# Altium schematic sheet 原理图.SchDoc
size A3
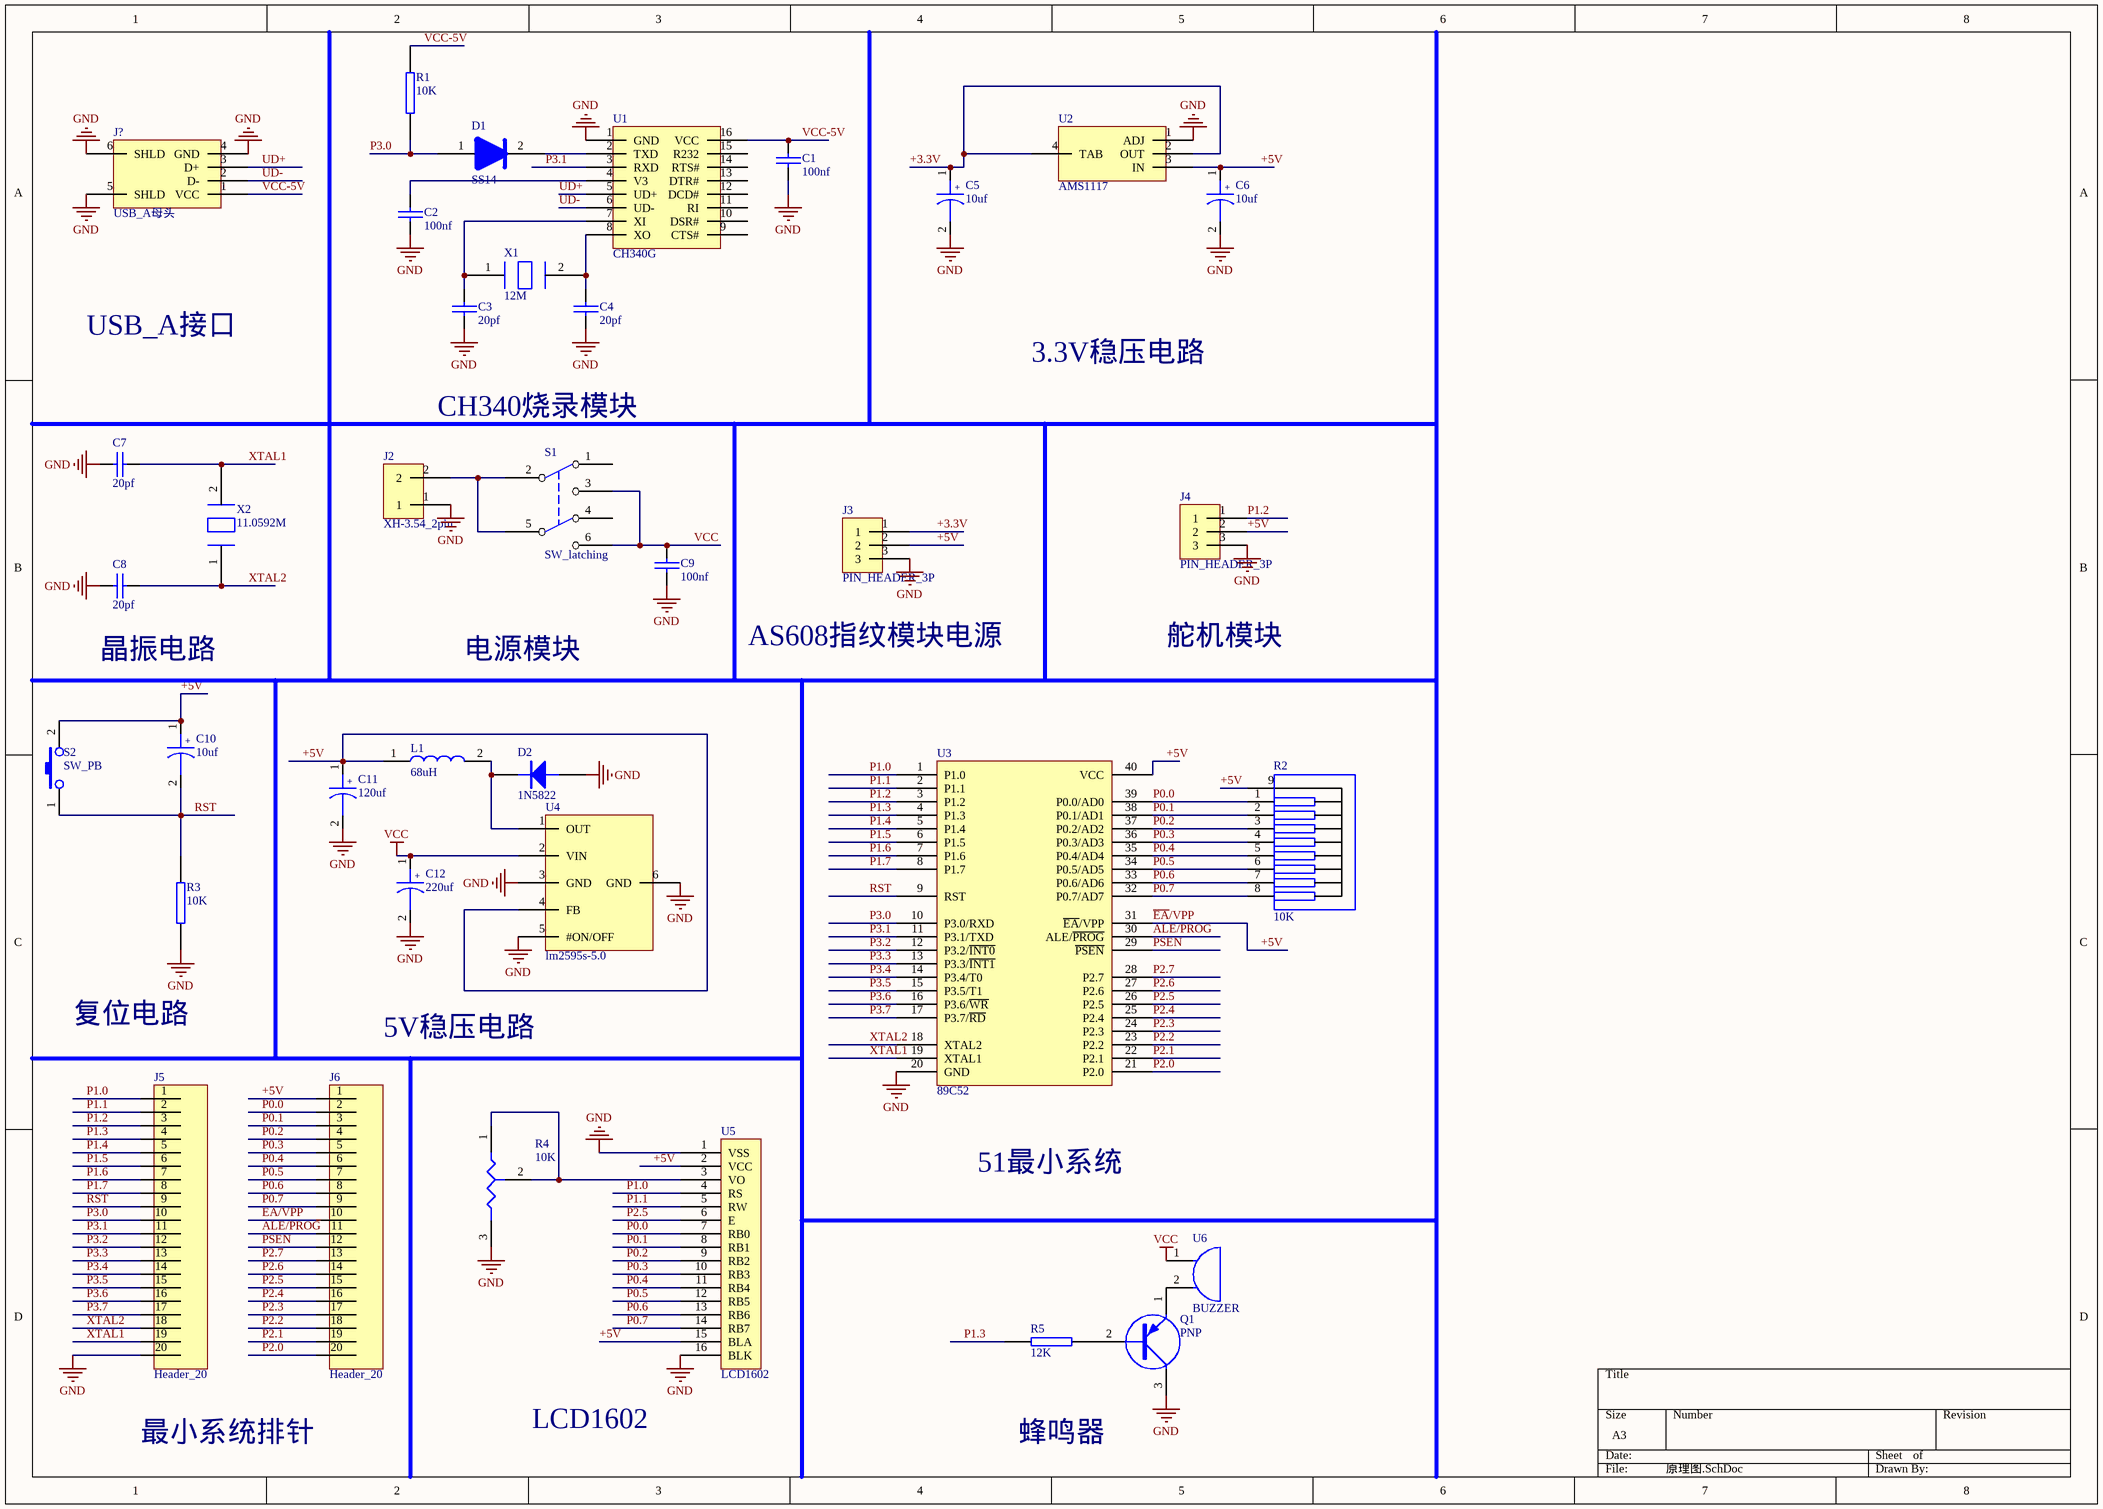
[diagram p0: 原理图.SchDoc]

## Parts
C1  100nf  [CAP_C]
C2  100nf  [CAP_C]
C3  20pf  [CAP_C]
C4  20pf  [CAP_C]
C5  10uf  [CAP_POL]
C6  10uf  [CAP_POL]
C7  20pf  [CAP_C]
C8  20pf  [CAP_C]
C9  100nf  [CAP_C]
C10  10uf  [CAP_POL]
C11  120uf  [CAP_POL]
C12  220uf  [CAP_POL]
D1  SS14  [DIODE_ss14]
D2  1N5822  [DIODE]
J2  XH-3.54_2pin  [XH-2.54_2pin]
J3  PIN_HEADER_3P  [PIN_HEADER_3P]
J4  PIN_HEADER_3P  [PIN_HEADER_3P]
J5  Header_20  [HEADER20]
J6  Header_20  [HEADER20]
J?  USB_A母头  [USB_A母头]
L1  68uH  [INDUC]
Q1  PNP  [PNP]
R1  10K  [RES]
R2  10K  [R SIP9-2.54]
R3  10K  [0805]
R4  10K  [3296W滑变]
R5  12K  [RES]
S1  SW_latching  [SW_latching]
S2  SW_PB  [KEY66]
U1  CH340G  [CH340G]
U2  AMS1117  [AMS1117]
U3  89C52  [DIP-40-插座]
U4  lm2595s-5.0  [LM2595S-5.0]
U5  LCD1602  [1602LCD]
U6  BUZZER  [buzzer]
X1  12M  [XTAL1]
X2  11.0592M  [XTAL1]

## Nets
GND: C1.2 C2.2 C3.2 C4.2 C5.2 C6.2 C7.1 C8.1 C9.2 C11.2 C12.2 D2.1(A) J2.1 J3.3 J4.3 J5.20 J?.4(GND) J?.5(SHLD) J?.6(SHLD) Q1.3(C) R3.1 R4.3(B) U1.1(GND) U2.1(ADJ) U3.20(GND) U4.3(GND) U4.5(#ON/OFF) U4.6(GND) U5.1(VSS) U5.16(BLK)
VCC: C9.1 C12.1 S1.3(ON1) S1.6(ON2) U4.2(VIN) U6.1(A)
+3.3V: C5.1 J3.1 U2.2(OUT) U2.4(TAB)
+5V: C6.1 C10.1 C11.1 J3.2 J4.2 J6.1 J6.10 L1.1 R2.9 S2.2 U2.3(IN) U3.31(~{EA}/VPP) U3.40(VCC) U4.4(FB) U5.2(VCC) U5.15(BLA)  [also labelled ~{EA}/VPP]
ALE/~{PROG}: J6.11 U3.30(ALE/~{PROG})
P0.0: J6.2 R2.1 U3.39(P0.0/AD0) U5.7(RB0)
P0.1: J6.3 R2.2 U3.38(P0.1/AD1) U5.8(RB1)
P0.2: J6.4 R2.3 U3.37(P0.2/AD2) U5.9(RB2)
P0.3: J6.5 R2.4 U3.36(P0.3/AD3) U5.10(RB3)
P0.4: J6.6 R2.5 U3.35(P0.4/AD4) U5.11(RB4)
P0.5: J6.7 R2.6 U3.34(P0.5/AD5) U5.12(RB5)
P0.6: J6.8 R2.7 U3.33(P0.6/AD6) U5.13(RB6)
P0.7: J6.9 R2.8 U3.32(P0.7/AD7) U5.14(RB7)
P1.0: J5.1 U3.1(P1.0) U5.4(RS)
P1.1: J5.2 U3.2(P1.1) U5.5(RW)
P1.2: J4.1 J5.3 U3.3(P1.2)
P1.3: J5.4 R5.1 U3.4(P1.3)
P1.4: J5.5 U3.5(P1.4)
P1.5: J5.6 U3.6(P1.5)
P1.6: J5.7 U3.7(P1.6)
P1.7: J5.8 U3.8(P1.7)
P2.0: J6.20 U3.21(P2.0)
P2.1: J6.19 U3.22(P2.1)
P2.2: J6.18 U3.23(P2.2)
P2.3: J6.17 U3.24(P2.3)
P2.4: J6.16 U3.25(P2.4)
P2.5: J6.15 U3.26(P2.5) U5.6(E)
P2.6: J6.14 U3.27(P2.6)
P2.7: J6.13 U3.28(P2.7)
P3.0: D1.1(A) J5.10 R1.1 U3.10(P3.0/RXD)
P3.1: J5.11 U1.3(RXD) U3.11(P3.1/TXD)
P3.2: J5.12 U3.12(P3.2/~{INT0})
P3.3: J5.13 U3.13(P3.3/~{INT1})
P3.4: J5.14 U3.14(P3.4/T0)
P3.5: J5.15 U3.15(P3.5/T1)
P3.6: J5.16 U3.16(P3.6/~{WR})
P3.7: J5.17 U3.17(P3.7/~{RD})
~{PSEN}: J6.12 U3.29(~{PSEN})
RST: C10.2 J5.9 R3.2 S2.1 U3.9(RST)
UD+: J?.3(D+) U1.5(UD+)
UD-: J?.2(D-) U1.6(UD-)
VCC-5V: C1.1 J?.1(VCC) R1.2 U1.16(VCC)
XTAL1: C7.2 J5.19 U3.19(XTAL1) X2.2
XTAL2: C8.2 J5.18 U3.18(XTAL2) X2.1
NetC2_1: C2.1 U1.4(V3)
NetC3_1: C3.1 U1.7(XI) X1.1
NetC4_1: C4.1 U1.8(XO) X1.2
NetD1_2: D1.2(B) U1.2(TXD)
NetD2_2: D2.2(K) L1.2 U4.1(OUT)
NetJ2_2: J2.2 S1.2(COMMON1) S1.5(COMMON2)
NetQ1_1: Q1.1(E) U6.2(B)
NetQ1_2: Q1.2(B) R5.2
NetR4_1: R4.1(A) R4.2(TAP) U5.3(VO)

Not connected (* = marked no-connect by the designer): S1 1(NC1) 4(NC2); U1 9(CTS#) 10(DSR#) 11(RI) 12(DCD#) 13(DTR#) 14(RTS#) 15(R232)

## Notes on the sheet
- USB_A接口
- 3.3V稳压电路
- CH340烧录模块
- AS608指纹模块电源
- 舵机模块
- 晶振电路
- 电源模块
- 复位电路
- 5V稳压电路
- 51最小系统
- 最小系统排针
- LCD1602
- 蜂鸣器
- (in symbol CAP_POL) +

## Library data of the parts
C1-C4 C7-C9 = CAP_C: Capacitor
C5 C6 C10-C12 = CAP_POL: Capacitor
D1 = DIODE_ss14
D2 = DIODE
J5 J6 = Header20
L1 = INDUC
Q1 = PNP: PNP Transistor
R1 R5 = RES
R2 = R排阻
R3 = RES_1
R4 = RESISTOR TAPPED
S2 = SW-PB
X1 X2 = XPAL_2P